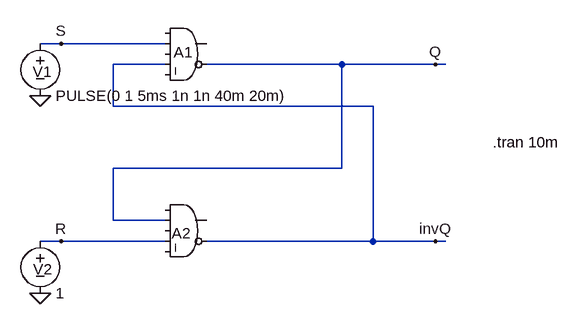
[diagram p0: schematic pregunta5.asc]
pregunta5.asc, the LTspice schematic file:
Version 4
SHEET 1 880 680
WIRE 32 112 0 112
WIRE 192 112 32 112
WIRE 192 144 112 144
WIRE 464 144 256 144
WIRE 608 144 464 144
WIRE 624 144 608 144
WIRE 112 208 112 144
WIRE 512 208 112 208
WIRE 464 304 464 144
WIRE 464 304 112 304
WIRE 112 384 112 304
WIRE 192 384 112 384
WIRE 32 416 0 416
WIRE 192 416 32 416
WIRE 512 416 512 208
WIRE 512 416 256 416
WIRE 608 416 512 416
WIRE 624 416 608 416
FLAG 608 144 Q
FLAG 608 416 invQ
FLAG 32 112 S
FLAG 32 416 R
FLAG 0 192 0
FLAG 0 496 0
SYMBOL Digital/and 224 64 R0
WINDOW 0 -19 61 Left 2
SYMATTR InstName A1
SYMBOL Digital/and 224 336 R0
WINDOW 0 -22 68 Left 2
SYMATTR InstName A2
SYMBOL voltage 0 96 R0
WINDOW 0 -12 59 Left 2
SYMATTR InstName V1
SYMATTR Value PULSE(0 1 5ms 1n 1n 40m 20m)
SYMBOL voltage 0 400 R0
WINDOW 0 -11 59 Left 2
SYMATTR InstName V2
SYMATTR Value 1
TEXT 696 264 Left 2 !.tran 10m

The netlist it stands for:
* pregunta5.asc
A1 0 S 0 invQ 0 Q 0 0 AND
A2 0 Q 0 R 0 invQ 0 0 AND
V1 S 0 PULSE(0 1 5ms 1n 1n 40m 20m)
V2 R 0 1
.tran 10m
.backanno
.end